# EAGLE design Esquematico (EAGLE 7.5.0)
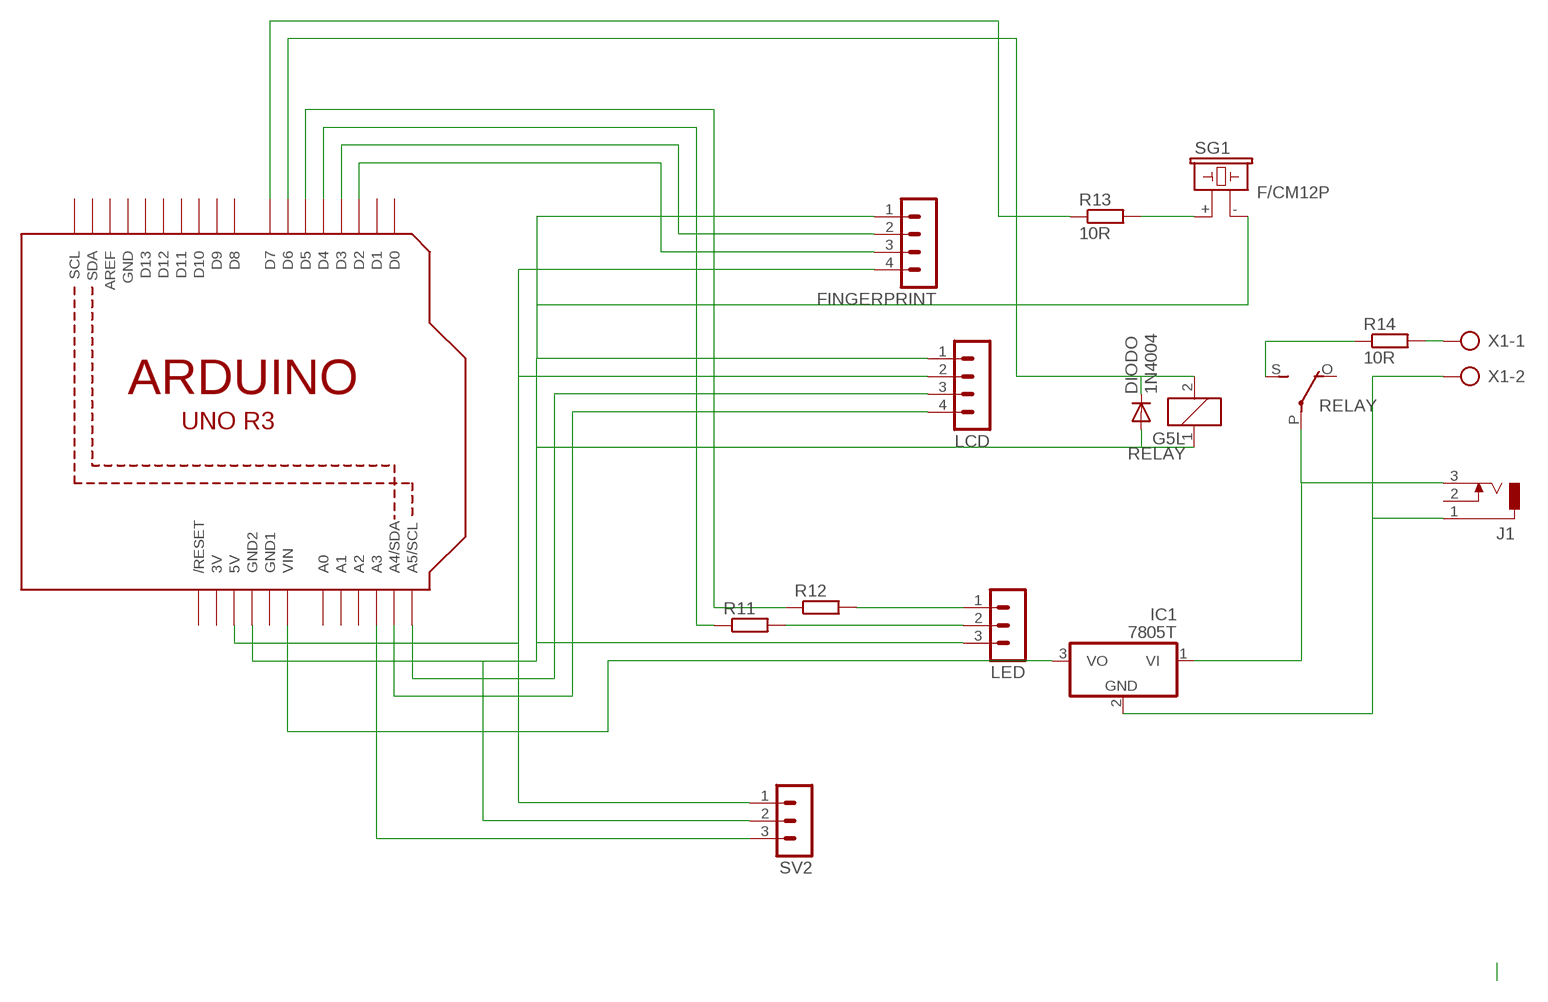
[diagram p0: schematic, sheet 1]

## Parts
DIODO  1N4004  [DO41-10]
FINGERPRINT  MA04-1  [MA04-1]
IC1  7805T  [TO220H]
J1  DCJ0303  [DCJ0303]
LCD  MA04-1  [MA04-1]
LED  MA03-1  [MA03-1]
Q1  ARDUINOR3-NOIOREF-NOTEXT  [ARDUINOR3-NOTEXT-NOIOREF]
R11  R-EU_0309/10  [0309/10]
R12  R-EU_0309/10  [0309/10]
R13  10R  R-EU_0309/10  [0309/10]
R14  10R  R-EU_0817/22  [P0817/22]
RELAY  G5L  [G5LE]
SG1  F/CM12P  [F/CM12P]
SV2  MA03-1  [MA03-1]
X1  AK300/2  [AK300/2]

## Nets
N$1: FINGERPRINT.4 LCD.2 Q1.5V SV2.1
N$2: DIODO.A FINGERPRINT.1 LCD.1 LED.3 Q1.GND2 RELAY.1 SG1.- SV2.2
N$3: FINGERPRINT.3 Q1.D2
N$4: FINGERPRINT.2 Q1.D3
N$5: LCD.3 Q1.A5(A5/SCL)
N$6: LCD.4 Q1.A4(A4/SDA)
N$7: DIODO.C Q1.D6 RELAY.2
N$9: Q1.D4 R11.1
N$10: Q1.D5 R12.1
N$11: Q1.D7 R13.1
N$12: R14.2 X1.1
N$13: IC1.2(GND) J1.1 X1.2
N$14: IC1.1(VI) J1.3 RELAY.P(2:P)
N$15: R14.1 RELAY.S(2:S)
N$16: IC1.3(VO) Q1.VIN
N$17: R13.2 SG1.+
N$18: LED.1 R12.2
N$19: LED.2 R11.2
N$20: Q1.A3 SV2.3
Unconnected: J1.2 Q1.A0 Q1.A1 Q1.A2 Q1.AREF Q1.D0 Q1.D1 Q1.D8 Q1.D9 Q1.D10 Q1.D11 Q1.D12 Q1.D13 Q1.RESET(/RESET) Q1.SCL Q1.SDA RELAY.O(2:O)

## Power pins joined to a net without a drawn wire
3V: Q1.3V
GND: Q1.GND
GND1: Q1.GND1

## Library data of the parts
DIODO = adafruit:1N4004: DIODE General purpose 1N400x type rectifier (With bigger pads) http://www.ladyada.net/library/pcb/eaglelibrary.html
FINGERPRINT LCD = con-lstb:MA04-1: PIN HEADER; OC_FARNELL: unknown; OC_NEWARK: unknown
IC1 = linear:78*: Positive VOLTAGE REGULATOR Source: http://cache.national.com/ds/LM/LM78L05.pdf http://www.fairchildsemi.com/ds/LM/LM7805.pdf
J1 = con-jack:DCJ0303: DC POWER JACK Source: DCJ0303.pdf; OC_FARNELL: unknown; OC_NEWARK: unknown
LED SV2 = con-lstb:MA03-1: PIN HEADER; OC_FARNELL: unknown; OC_NEWARK: unknown
Q1 = adafruit:ARDUINOR3-NOIOREF
R11-R14 = resistor:R-EU_: RESISTOR, European symbol
RELAY = relay:G5L: RELAY 1 x switch, 10 A/120 V AC, 8 A/30 V ADC, Omron; OC_FARNELL: unknown; OC_NEWARK: unknown
SG1 = buzzer:F/CM12P: BUZZER Source: Buerklin; OC_FARNELL: unknown; OC_NEWARK: unknown
X1 = con-ptr500:AK300/2: CONNECTOR; OC_FARNELL: unknown; OC_NEWARK: unknown

## Board
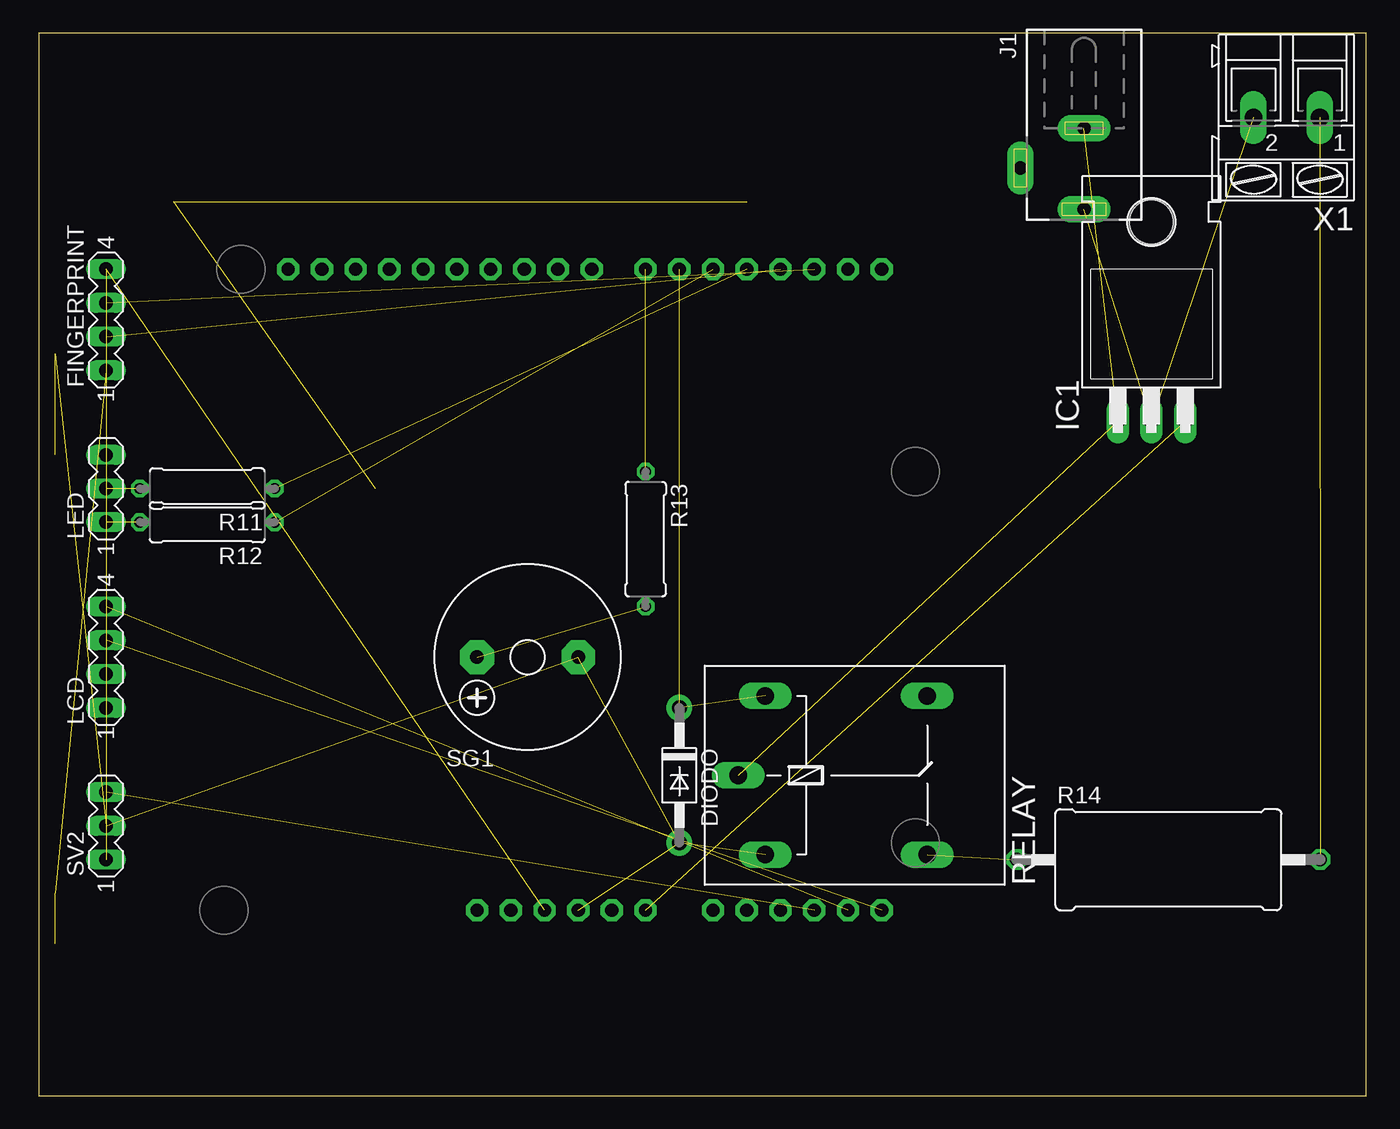
[diagram p1: board, top side]
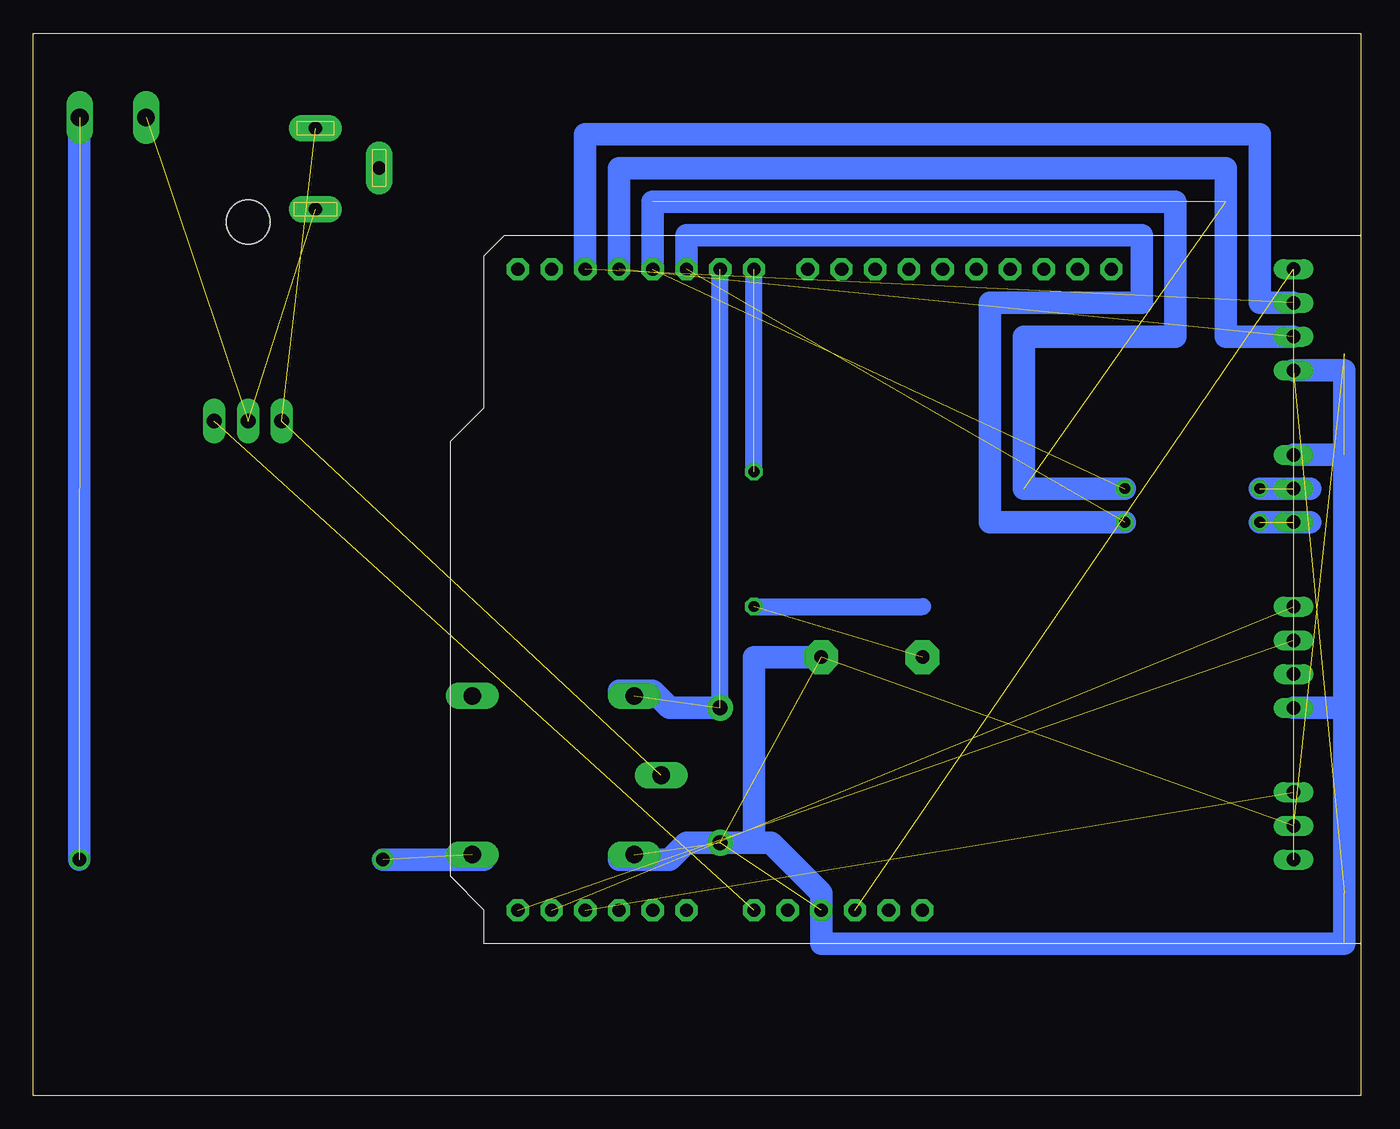
[diagram p2: board, bottom side, seen from below]

Size 100 x 80 mm. Coordinates in mm from the lower left corner, seen from the top.
Outline: 0,0 100,0 100,80 0,80 0,0
Copper layers (1*16): Top 0.035mm / dielectric 1.5mm / Bottom 0.035mm
Design rules "default": minimum track width 10mil, minimum drill 24mil, track to track 8mil, track to pad 8mil, pad to pad 8mil, via to via 8mil, smd to smd 8mil, copper to edge 40mil, drill to drill 8mil, minimum pad ring 10mil, minimum via ring 8mil, stop-mask expansion 4mil, vias tented up to drill 0mil, thermal gap 10mil

### Footprints (pad centres in the part's own frame; a part is rotated, then mirrored left to right if it is on the bottom)
DO41-10 = drill 1.118 pad 1.93: A 5.08,0; C -5.08,0
MA04-1 = drill 1.016 long: 1 -3.81,0; 2 -1.27,0; 3 1.27,0; 4 3.81,0
TO220H = drill 1.118 long: 1 -2.54,-10.16; 2 0,-10.16; 3 2.54,-10.16 | hole 3.302: 0,4.826
DCJ0303 = drill 1 pad 2 long: 1 0,3.1; 2 4.8,0; 3 0,-3
MA03-1 = drill 1.016 long: 1 -2.54,0; 2 0,0; 3 2.54,0
ARDUINOR3-NOTEXT-NOIOREF = drill 1 pad 1.676 octagon: 3V 35.56,2.54; 5V 38.1,2.54; A0 50.8,2.54; A1 53.34,2.54; A2 55.88,2.54; A3 58.42,2.54; A4 60.96,2.54; A5 63.5,2.54; AREF 23.876,50.8; D0 63.5,50.8; D1 60.96,50.8; D2 58.42,50.8; D3 55.88,50.8; D4 53.34,50.8; D5 50.8,50.8; D6 48.26,50.8; D7 45.72,50.8; D8 41.656,50.8; D9 39.116,50.8; D10 36.576,50.8; D11 34.036,50.8; D12 31.496,50.8; D13 28.956,50.8; GND 26.416,50.8; GND1 43.18,2.54; GND2 40.64,2.54; RESET 33.02,2.54; SCL 18.796,50.8; SDA 21.336,50.8; VIN 45.72,2.54
0309/10 = drill 0.813 octagon: 1 -5.08,0; 2 5.08,0
P0817/22 = drill 1.016 octagon: 1 -11.43,0; 2 11.43,0
G5LE = drill 1.321 long: 1 -7.493,-5.969; 2 -7.493,5.969; O 4.699,5.969; P -9.525,0; S 4.699,-5.969
F/CM12P = drill 1.016 pad 2.54 octagon: + 3.81,0; - -3.81,0
AK300/2 = drill 1.321 long: 1 -2.515,0; 2 2.489,0

### Placement (x,y rotation side)
DIODO  48.26,24.13 270 top
FINGERPRINT  5.08,58.42 90 top
IC1  83.82,60.96 0 top
J1  78.74,69.85 180 top
LCD  5.08,33.02 90 top
LED  5.08,45.72 90 top
Q1  0,11.43 0 top
R11  12.7,45.72 180 top
R12  12.7,43.18 180 top
R13  45.72,41.91 270 top
R14  85.09,17.78 0 top
RELAY  62.23,24.13 0 top
SG1  36.83,33.02 180 top
SV2  5.08,20.32 90 top
X1  93.98,73.66 180 top

### Tracks (layer width: path | path; a pad name or v marks a point on that pad's centre or on a via)
N$1  (3 unrouted)
N$2  (11 unrouted)
  Bottom 1.676: 55.88,17.78 52.07,17.78 50.8,19.05 DIODO.A 45.72,19.05 | 45.72,19.05 44.45,19.05 40.64,15.24 Q1.GND2 40.64,11.43 1.27,11.43 1.27,29.21 | SG1.- 45.72,33.02 45.72,19.05 | 1.27,29.21 1.27,48.26 | LCD.1 1.27,29.21 | LED.3 1.27,48.26 | 1.27,48.26 1.27,54.61 FINGERPRINT.1
N$3  (1 unrouted)
  Bottom 1.676: FINGERPRINT.3 7.62,59.69 7.62,72.39 58.42,72.39 Q1.D2
N$4  (1 unrouted)
  Bottom 1.676: FINGERPRINT.2 10.16,57.15 10.16,69.85 55.88,69.85 Q1.D3
N$5  (1 unrouted)
N$6  (1 unrouted)
N$7  (2 unrouted)
  Bottom 1.27: DIODO.C Q1.D6
  Bottom 1.676: DIODO.C 52.07,29.21 53.34,30.48 55.88,30.48
N$9  (3 unrouted)
  Bottom 1.676: R11.1 25.4,45.72 25.4,57.15 13.97,57.15 13.97,67.31 53.34,67.31 Q1.D4
N$10  (1 unrouted)
  Bottom 1.676: R12.1 27.94,43.18 27.94,59.69 16.51,59.69 16.51,64.77 50.8,64.77 Q1.D5
N$11  (1 unrouted)
  Bottom 1.27: R13.1 Q1.D7
N$12  (1 unrouted)
  Bottom 1.676: 96.52,73.66 R14.2
N$13  (2 unrouted)
N$14  (2 unrouted)
N$15  (1 unrouted)
  Bottom 1.676: R14.1 66.04,17.78
N$16  (1 unrouted)
N$17  (1 unrouted)
  Bottom 1.27: R13.2 33.02,36.83
N$18  (1 unrouted)
  Bottom 1.676: 3.81,43.18 R12.2
N$19  (1 unrouted)
  Bottom 1.676: R11.2 3.81,45.72
N$20  (1 unrouted)